# Altium schematic sheet Block.SchDoc: Title
size A3; Date: Date; CompanyName: Integrated Micro-Electronics Bulgaria; Organization: Design & Development Department; Address1: Drawing Type; Address2: Address 1; Address3: Address 2; Address4: Address 3; DocumentNumber: 730xxx; Revision: 01; SheetNumber: 1; SheetTotal: 1; PageSetup: Record=PageOptions|CenterHorizontal=True|CenterVertical=True|PrintScale=0.70|XCorrection=1.00|YCorrection=1.00|PrintKind=2|BorderSize=5000000|LeftOffset=0|BottomOffset=0|Orientation=2|PaperLength=1000|PaperWidth=1000|Scale=100|PaperSource=7|PrintQuality=-4|MediaType=1|DitherType=10|PaperKind=11" x 17"|PrintScaleMode=1; SheetSize: A3; Time: Time; ModifiedDate: Mod. Date
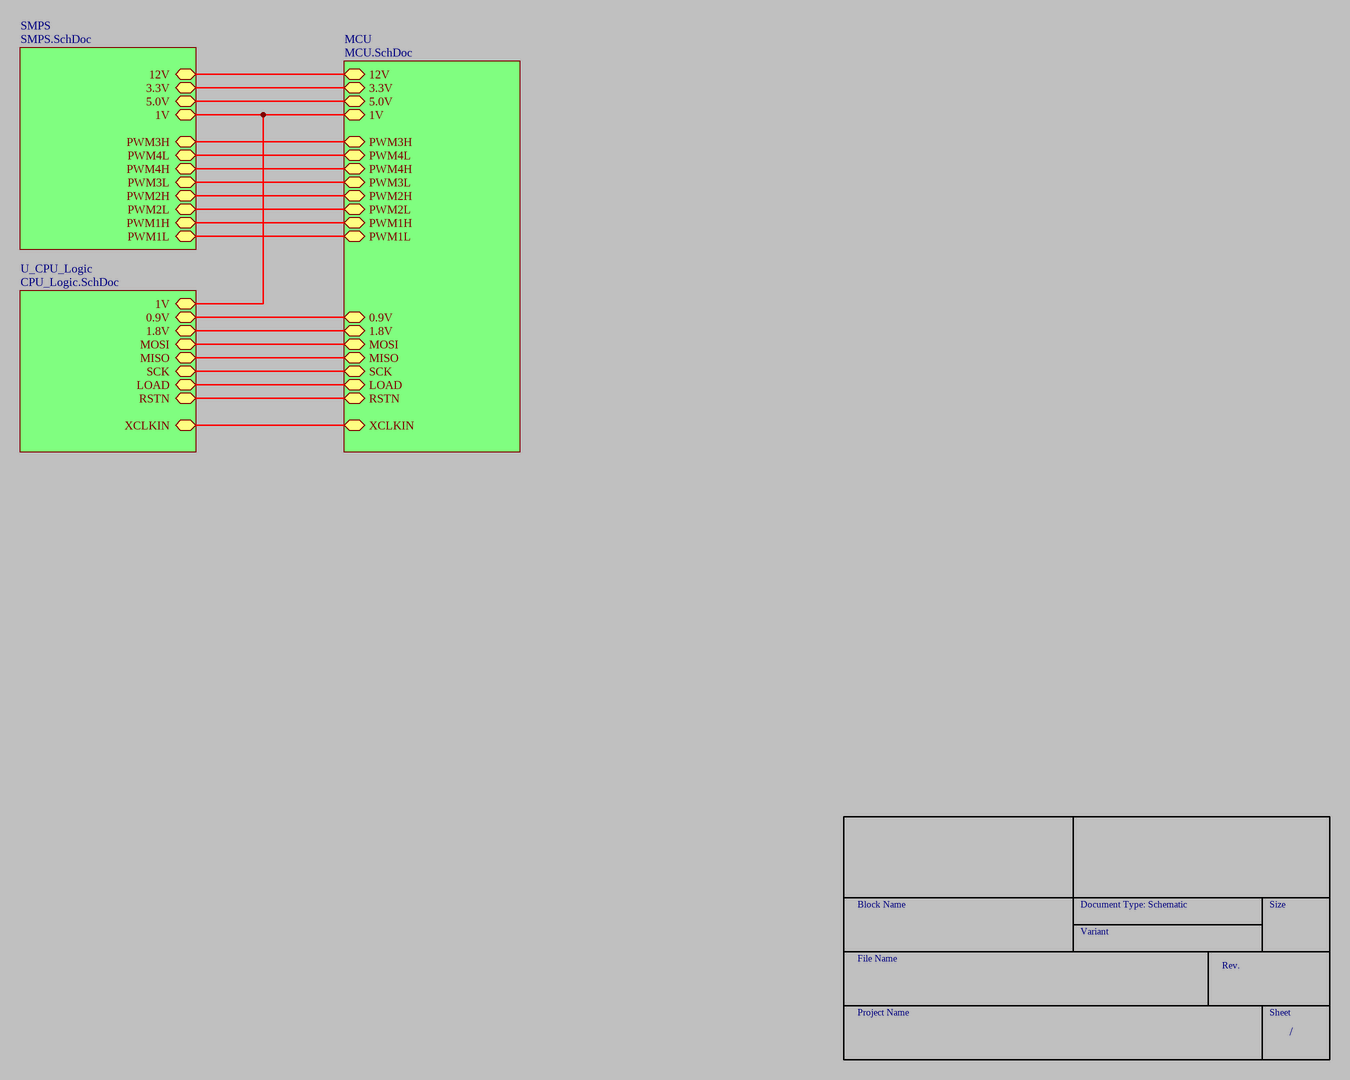
[diagram p0: Block.SchDoc]

## Sub-sheets
MCU = MCU.SchDoc: 1V, 12V, 3.3V, 5.0V, PWM3H, PWM4L, PWM4H, PWM3L, PWM2H, PWM2L, PWM1H, PWM1L, 1.8V, 0.9V, LOAD, RSTN, MOSI, MISO, SCK, XCLKIN
SMPS = SMPS.SchDoc: 1V, 12V, 3.3V, 5.0V, PWM3H, PWM4L, PWM4H, PWM3L, PWM2H, PWM2L, PWM1H, PWM1L
U_CPU_Logic = CPU_Logic.SchDoc: 1.8V, 0.9V, 1V, LOAD, RSTN, MOSI, MISO, SCK, XCLKIN

## Nets
(unnamed): sheet U_CPU_Logic/1.8V, sheet MCU/1.8V
(unnamed): sheet U_CPU_Logic/0.9V, sheet MCU/0.9V
(unnamed): sheet U_CPU_Logic/1V, sheet MCU/1V, sheet SMPS/1V
(unnamed): sheet U_CPU_Logic/LOAD, sheet MCU/LOAD
(unnamed): sheet U_CPU_Logic/RSTN, sheet MCU/RSTN
(unnamed): sheet U_CPU_Logic/MOSI, sheet MCU/MOSI
(unnamed): sheet U_CPU_Logic/MISO, sheet MCU/MISO
(unnamed): sheet U_CPU_Logic/SCK, sheet MCU/SCK
(unnamed): sheet U_CPU_Logic/XCLKIN, sheet MCU/XCLKIN
(unnamed): sheet MCU/12V, sheet SMPS/12V
(unnamed): sheet MCU/3.3V, sheet SMPS/3.3V
(unnamed): sheet MCU/5.0V, sheet SMPS/5.0V
(unnamed): sheet MCU/PWM3H, sheet SMPS/PWM3H
(unnamed): sheet MCU/PWM4L, sheet SMPS/PWM4L
(unnamed): sheet MCU/PWM4H, sheet SMPS/PWM4H
(unnamed): sheet MCU/PWM3L, sheet SMPS/PWM3L
(unnamed): sheet MCU/PWM2H, sheet SMPS/PWM2H
(unnamed): sheet MCU/PWM2L, sheet SMPS/PWM2L
(unnamed): sheet MCU/PWM1H, sheet SMPS/PWM1H
(unnamed): sheet MCU/PWM1L, sheet SMPS/PWM1L

## Notes on the sheet
- Block Name
- Document Type: Schematic
- Size
- File Name
- Variant
- Rev.
- Project Name
- Sheet
- /